# Altium schematic sheet power.SchDoc
size A4
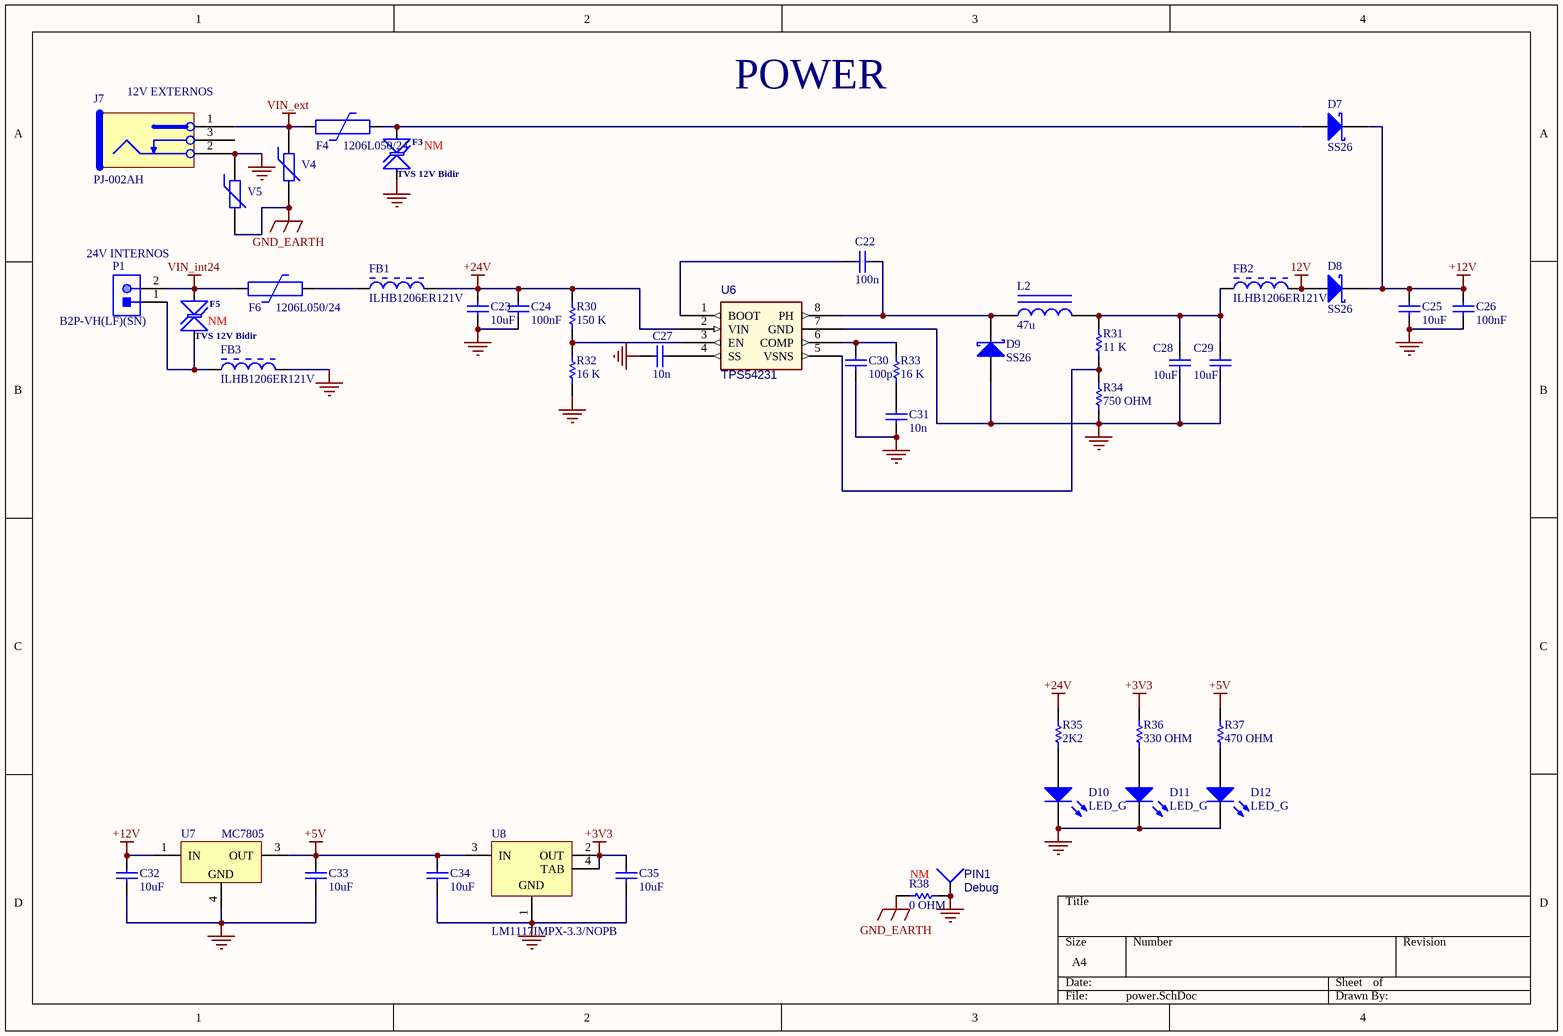
[diagram p0: power.SchDoc]

## Parts
C22  100n  [0603]
C23  10uF  [1206]
C24  100nF  [0805]
C25  10uF  [1206]
C26  100nF  [0805]
C27  10n  [0603]
C28  10uF  [1206]
C29  10uF  [1206]
C30  100p  [0603]
C31  10n  [0603]
C32  10uF  [1206]
C33  10uF  [0805]
C34  10uF  [1206]
C35  10uF  [0805]
D7  SS26  [SMB]
D8  SS26  [SMB]
D9  SS26  [SMB]
D10  LED_G  [LED0603G]
D11  LED_G  [LED0603G]
D12  LED_G  [LED0603G]
F3  TVS 12V Bidir  [DO-214AA]
F4  1206L050/24  [POLYFUSE_1206L]
F5  TVS 12V Bidir  [DO-214AA]
F6  1206L050/24  [POLYFUSE_1206L]
FB1  ILHB1206ER121V  [1206]
FB2  ILHB1206ER121V  [1206]
FB3  ILHB1206ER121V  [1206]
J7  PJ-002AH  [POWER_JACK_5.5_2.1MM_NS_v1.1]
L2  47u  [SRU1048-470Y]
P1  B2P-VH(LF)(SN)  [JST-B2P-VH(LF)(SN)_V]
PIN1  Debug  [PIN_Debug]
R30  150 K  [R0603]
R31  11 K  [R0603]
R32  16 K  [R0603]
R33  16 K  [R0603]
R34  750 OHM  [R0603]
R35  2K2  [R0603]
R36  330 OHM  [R0603]
R37  470 OHM  [R0603]
R38  0 OHM  [R1206]
U6  TPS54231  [SO08]
U7  MC7805  [D2PAK]
U8  LM1117IMPX-3.3/NOPB  [SOT223_]
V4  VC080526C580  [VC080526C580]  (value not drawn)
V5  VC080526C580  [VC080526C580]  (value not drawn)

## Nets
12V: D8.1(A) FB2.2
+3V3: C35.2 R36.2 U8.2(OUT) U8.4(TAB)
+5V: C33.2 C34.2 R37.2 U7.3(OUT) U8.3(IN)
+12V: C25.1 C26.2 C32.2 D7.2(K) D8.2(K) U7.1(IN)
+24V: C23.2 C24.2 FB1.2 R30.2 R35.2 U6.2(VIN)
GND: C23.1 C24.1 C25.2 C26.1 C27.2 C28.1 C29.1 C30.1 C31.1 C32.1 C33.1 C34.1 C35.1 D9.1(A) D10.2(K) D11.2(K) D12.2(K) F3.1(A) FB3.2 J7.2 PIN1.1 R32.1 R34.1 R38.2 U6.7(GND) U7.4(GND) U8.1(GND) V5.1
GND_EARTH: R38.1 V4.2 V5.2
VIN_ext: F4.1 J7.1 V4.1
VIN_int24: F5.2(K) F6.1 P1.2
NetC22_1: C22.1 U6.1(BOOT)
NetC22_2: C22.2 D9.2(K) L2.1 U6.8(PH)
NetC27_1: C27.1 U6.4(SS)
NetC28_2: C28.2 C29.2 FB2.1 L2.2 R31.2
NetC30_2: C30.2 R33.2 U6.6(COMP)
NetC31_2: C31.2 R33.1
NetD7_1: D7.1(A) F3.2(K) F4.2
NetD10_1: D10.1(A) R35.1
NetD11_1: D11.1(A) R36.1
NetD12_1: D12.1(A) R37.1
NetF5_1: F5.1(A) FB3.1 P1.1
NetF6_2: F6.2 FB1.1
NetR30_1: R30.1 R32.2 U6.3(EN)
NetR31_1: R31.1 R34.2 U6.5(VSNS)

Not connected (* = marked no-connect by the designer): J7 3

## Notes on the sheet
- (near J7) 12V EXTERNOS
- POWER
- (near F3) NM
- (near P1) 24V INTERNOS
- (near F5) NM
- (near R38) NM

## Library data of the parts
C22 = 6003071: Capacitor; Value: 100pF; DescripcionArticulo: COND. CERAMICO SMD 0603 100 NF X7R 50V 10%; tipo: condensador; Published: 8-Jun-2000; LatestRevisionDate: 17-Jul-2002; LatestRevisionNote: Re-released for DXP Platform.; PackageReference: RAD-0.3; Publisher: Altium Limited; PackageDescription: Radial Cap, Thru-Hole; 2 Leads; 0.3 in Pin Spacing; Codigo: 6003071; valor: 100n
C23 C25 C28 C29 C32 C34 = 6003031: Capacitor; Value: 100pF; DescripcionArticulo: COND. CERAMICO SMD 1206 10 UF X5R 35V 10%; tipo: condensador; Published: 8-Jun-2000; LatestRevisionDate: 17-Jul-2002; LatestRevisionNote: Re-released for DXP Platform.; PackageReference: RAD-0.3; Publisher: Altium Limited; PackageDescription: Radial Cap, Thru-Hole; 2 Leads; 0.3 in Pin Spacing; Codigo: 6003031; valor: 10uF
C24 C26 = 6003010: Capacitor; Value: 100pF; DescripcionArticulo: COND. CERAMICO SMD 0805 100 NF 50V 10%; tipo: condensador; Published: 8-Jun-2000; LatestRevisionDate: 17-Jul-2002; LatestRevisionNote: Re-released for DXP Platform.; PackageReference: RAD-0.3; Publisher: Altium Limited; PackageDescription: Radial Cap, Thru-Hole; 2 Leads; 0.3 in Pin Spacing; Codigo: 6003010; valor: 100nF
C27 C31 = 6003067: Capacitor; Value: 100pF; DescripcionArticulo: COND. CERAMICO SMD 0603 10 NF X7R 50V 10%; tipo: condensador; Published: 8-Jun-2000; LatestRevisionDate: 17-Jul-2002; LatestRevisionNote: Re-released for DXP Platform.; PackageReference: RAD-0.3; Publisher: Altium Limited; PackageDescription: Radial Cap, Thru-Hole; 2 Leads; 0.3 in Pin Spacing; Codigo: 6003067; valor: 10n
C30 = 6003092: Capacitor; Value: 100pF; DescripcionArticulo: COND. CERAMICO SMD 0603 100 PF X5R 50V 10%; tipo: condensador; Published: 8-Jun-2000; LatestRevisionDate: 17-Jul-2002; LatestRevisionNote: Re-released for DXP Platform.; PackageReference: RAD-0.3; Publisher: Altium Limited; PackageDescription: Radial Cap, Thru-Hole; 2 Leads; 0.3 in Pin Spacing; Codigo: 6003092; valor: 100p
C33 C35 = 6003114: Capacitor; Value: 100pF; DescripcionArticulo: COND. CERAMICO SMD 0805 10 UF 6.3V -10V; tipo: condensador; Published: 8-Jun-2000; LatestRevisionDate: 17-Jul-2002; LatestRevisionNote: Re-released for DXP Platform.; PackageReference: RAD-0.3; Publisher: Altium Limited; PackageDescription: Radial Cap, Thru-Hole; 2 Leads; 0.3 in Pin Spacing; Codigo: 6003114; valor: 10uF
D7-D9 = 6006033: Schottky Diode; DescripcionArticulo: DIODO SS26 SCHOTTKY CASE: SMB  2AMP 60V; Descripcion2Articulo: /ONsemi/Vishay/Farchild/TaiwanS; Escandallo: Sí; tipo: diodo; Published: 8-Jun-2000; LatestRevisionDate: 17-Jul-2002; LatestRevisionNote: Re-released for DXP Platform.; PackageReference: SMB; Publisher: Altium Limited; PackageDescription: DO-214-AA/SMB; 2 C-Bend Leads; Body 5.3 x 3.6 mm, inc. leads (LxW); Code_JEDEC: DO-214-AA; Codigo: 6006033; valor: SS26
D10-D12 = 6006022: Typical RED, GREEN, YELLOW, AMBER GaAs LED; DescripcionArticulo: DIODO LED VERDE SML-LX0603GW 1.6X0.8X0.6; Escandallo: Sí; tipo: diodo; Published: 8-Jun-2000; LatestRevisionDate: 17-Jul-2002; LatestRevisionNote: Re-released for DXP Platform.; PackageVersion: Feb-2002; PackageReference: 3.2X1.6X1.1; Publisher: Altium Limited; PackageDescription: SM LED; 2 Flat Leads; Codigo: 6006022; valor: LED_G
F3 F5 = SMBJ12CA: TVS 12V 600W Bidir SMD; Fabricante: Littelfuse; Referencia: SMBJ12CA; Value: TVS 12V Bidir; Montaje: -
F4 F6 = POLYFUSE_1206L050/24: www.digikey.com: 507-1803-1-ND
FB1-FB3 = 4039004: Chip Ferrite Bead for Power Lines, 33 Ohm, 6000 mA, , -55 to 125 degC, 3.2 x 1.6 x 1.3 mm SMD, Tape and Reel; DescripcionArticulo: FERRITA ILHB1206ER121V 6A-0.02; Escandallo: Sí; Codigo: 4039004; valor: ILHB1206ER121V; tipo: ferrita
J7 = PJ-002AH_v1.1: CONN PWR JACK 2.1X5.5MM HIGH CUR; Manufacturer: CUI Inc; .Checked PCB: MM; Mating connector: 2.1mm ID, 5.5mm OD; Gender: Male; Number of Positions/Contacts: 2 Conductors, 3 Contacts; Internal Switch(s): Single Switch, Normally Closed; Shielding: Unshielded; Voltage - Rated: 24VDC; Current Rating: 5A; .Checked SCH: MM; Category: Connectors, Interconnects; Family: Barrel - Power; Manufacturer Part Number: PJ-002AH; Operating Temperature: -25°C ~ 85°C; Price 1k [$]: 0.23625; Supplier: Digikey; Supplier Part Number: CP-002AH-ND; Value: PJ-002AH; Supplier 1: Digi-Key; Supplier Part Number 1: CP-002AH-ND; RoHS: RoHS Compliant; Stock 1: 138933; Pricing 1: 1=1.01, 10=0.704, 100=0.4724, 500=0.3819, 1000=0.3417, 2500=0.27135 (USD); Connector Type: Jack; Plug/Mating Plug Diameter: 2.1mm ID, 5.5mm OD; Mounting Type: Through Hole, Right Angle; Termination: Solder Eyelet(s); Features: -; Color: Black; Contact Material: Copper Alloy; Contact Material - Plating: Nickel; Housing Color: Black; Housing Material: Thermoplastic; ComponentLink1URL: http://products.cui.com/GetSpecForDigiKey.aspx?MFGNum=PJ-002AH; ComponentLink1Description: http://products.cui.com/GetSpecForDigiKey.aspx?MFGNum=PJ-002AH; .Creator: MM; www.digikey.com: CP-002AH-ND
L2 = SRU1048-470Y: www.digikey.com: SRU1048-470YCT-ND
P1 = 5110017: Male Header, Pitch 3.96 mm, 1 x 2 Position, Height 10.9 mm, Tail Length 3.7 mm, -25 to 85 degC, RoHS, Bulk; Capacitance: 27 pF; Type (Capacitors): C0G; Voltage Rating (DC): 50 V; Resistance: 100000000000 Ohm; Tolerance: 5%; DescripcionArticulo: CONEC. MACHO RECTO 2 VIA C.I PASO 3,96MM; Escandallo: Sí; tipo: conector; ComponentLink2Description: Datasheet; Height: 0.8 mm; Radiation Hardening: No; Pins: 2; Package Quantity: 4000; Max Operating Temperature: 125degC; Width: 0.8 mm; PackageDescription: Male Header, Pitch 3.96 mm, 1 x 2 Position, Height 10.9 mm, Tail Length 3.7 mm; Case/Package: 0603; PackageReference: B2P-VH(LF)(SN); Voltage Rating: 50 V; REACH SVHC: No SVHC; Mount: Surface Mount; Min Operating Temperature: -55degC; Case Code (Metric): 1608; ComponentLink2URL: http://www.jst-mfg.com/product/pdf/eng/eVH.pdf; DatasheetVersion: May-16; RoHSCompliant: True; ComponentLink1Description: Manufacturer URL; Case Code (Imperial): 0603; Length: 1.6 mm; Packaging: Tape and Reel; ComponentLink1URL: http://www.jst.com/home2.html; Codigo: 5110017; valor: B2P-VH(LF)(SN)
PIN1 = Pin_Debug: PIN DE NET PUNTUAL /Pin Strip; Sallen Ref: 05190126; Codigo: 05190126
R30 = 6005109: Resistor; Value: 1K; DescripcionArticulo: RESISTENCIA SMD 0603 150 K, 1% 0.1W; tipo: resistencia; Published: 8-Jun-2000; LatestRevisionDate: 17-Jul-2002; LatestRevisionNote: Re-released for DXP Platform.; PackageReference: AXIAL-0.3; Publisher: Altium Limited; PackageDescription: Axial Device, Thru-Hole; 2 Leads; 0.3 in Pin Spacing; Codigo: 6005109; valor: 150 K
R31 = 6005127: Resistor; Value: 1K; DescripcionArticulo: RESISTENCIA SMD 0603 11 K, 1% 0.1W; tipo: resistencia; Published: 8-Jun-2000; LatestRevisionDate: 17-Jul-2002; LatestRevisionNote: Re-released for DXP Platform.; PackageReference: AXIAL-0.3; Publisher: Altium Limited; PackageDescription: Axial Device, Thru-Hole; 2 Leads; 0.3 in Pin Spacing; Codigo: 6005127; valor: 11 K
R32 R33 = 6005123: Resistor; Value: 1K; DescripcionArticulo: RESISTENCIA SMD 0603 16 K, 1% 0.1W; tipo: resistencia; Published: 8-Jun-2000; LatestRevisionDate: 17-Jul-2002; LatestRevisionNote: Re-released for DXP Platform.; PackageReference: AXIAL-0.3; Publisher: Altium Limited; PackageDescription: Axial Device, Thru-Hole; 2 Leads; 0.3 in Pin Spacing; Codigo: 6005123; valor: 16 K
R34 = 6005131: Resistor; Value: 1K; DescripcionArticulo: RESISTENCIA SMD 0603 750 OHM, 1% 0.1W; tipo: resistencia; Published: 8-Jun-2000; LatestRevisionDate: 17-Jul-2002; LatestRevisionNote: Re-released for DXP Platform.; PackageReference: AXIAL-0.3; Publisher: Altium Limited; PackageDescription: Axial Device, Thru-Hole; 2 Leads; 0.3 in Pin Spacing; Codigo: 6005131; valor: 750 OHM
R35 = 6005073: Resistor; Value: 1K; DescripcionArticulo: RESISTENCIA SMD 0603 2K2, 1% 0.1W; tipo: resistencia; Published: 8-Jun-2000; LatestRevisionDate: 17-Jul-2002; LatestRevisionNote: Re-released for DXP Platform.; PackageReference: AXIAL-0.3; Publisher: Altium Limited; PackageDescription: Axial Device, Thru-Hole; 2 Leads; 0.3 in Pin Spacing; Codigo: 6005073; valor: 2K2
R36 = 6005080: Resistor; Value: 1K; DescripcionArticulo: RESISTENCIA SMD 0603 330 OHM, 1% 0.1W; tipo: resistencia; Published: 8-Jun-2000; LatestRevisionDate: 17-Jul-2002; LatestRevisionNote: Re-released for DXP Platform.; PackageReference: AXIAL-0.3; Publisher: Altium Limited; PackageDescription: Axial Device, Thru-Hole; 2 Leads; 0.3 in Pin Spacing; Codigo: 6005080; valor: 330 OHM
R37 = 6005076: Resistor; Value: 1K; DescripcionArticulo: RESISTENCIA SMD 0603 470 OHM, 1%; tipo: resistencia; Published: 8-Jun-2000; LatestRevisionDate: 17-Jul-2002; LatestRevisionNote: Re-released for DXP Platform.; PackageReference: AXIAL-0.3; Publisher: Altium Limited; PackageDescription: Axial Device, Thru-Hole; 2 Leads; 0.3 in Pin Spacing; Codigo: 6005076; valor: 470 OHM
R38 = 6005142: Resistor; Value: 1K; DescripcionArticulo: RESISTENCIA SMD 1206 0 OHM, 1%; tipo: resistencia; Published: 8-Jun-2000; LatestRevisionDate: 17-Jul-2002; LatestRevisionNote: Re-released for DXP Platform.; PackageReference: AXIAL-0.3; Publisher: Altium Limited; PackageDescription: Axial Device, Thru-Hole; 2 Leads; 0.3 in Pin Spacing; Codigo: 6005142; valor: 0 OHM
U6 = TPS54231: 2A, 28V INPUT, STEP DOWN SWIFT™ DC/DC CONVERTER WITH ECO-MODE; Part Number: TEXAS TPS54231D; PROVIDER: ISEE; Sallen Ref: 06001119; Codigo: 06001119
U7 = 6004008: DescripcionArticulo: TRANSISTOR SMD MC78M05CDTRK; Escandallo: Sí; Codigo: 6004008
U8 = 6001155: 800mA Low-Dropout Linear Regulator, 4-pin SOT-223, Pb-Free; Manufacturer: National Semiconductor; CompType: LDO IC; PackageTopMarking: XYTT*N05B; High-Reliability: Y; PowerWise: N; DescripcionArticulo: IC SMD  LM1117IMP-3.3/NOPB - V REG, LINEAR, 3.3V; Descripcion2Articulo: Case Style:SOT-223; Escandallo: Sí; tipo: integrado; ComponentLink3Description: LM1117 Web Page; Code_JEDEC: TO-261-AA; RoHS: Y; PackageReference: MP04A; ComponentLink3URL: http://www.national.com/pf/LM/LM1117.html; RevisionNote: SCH symbol layout adjusted; ComponentLink2URL: http://www.national.com/ds/LM/LM1117.pdf; ComponentLink2Description: LM1117 Datasheet; ComponentLink1Description: Manufacturer URL; ComponentLink4Description: MP04A Package Page; ComponentLink4URL: http://www.national.com/packaging/folders/mp04a.html; PackageVersion: revB, Apr-2003; DatasheetVersion: Apr-2006; PackageDescription: Molded SOT-223, 6.50 x 3.56 x 1.6mm Body, 4 Lead, 2.3mm Pitch; Code_IPC: SOT223-4; ComponentLink1URL: http://www.national.com/; PinCount: 4; PartNumber: LM1117IMPX-3.3/NOPB; Codigo: 6001155; valor: LM1117IMPX-3.3/NOPB
V4 V5 = VC080526C580: Varistor (Voltage-Sensitive Resistor); www.digikey.com: 478-2514-6-ND